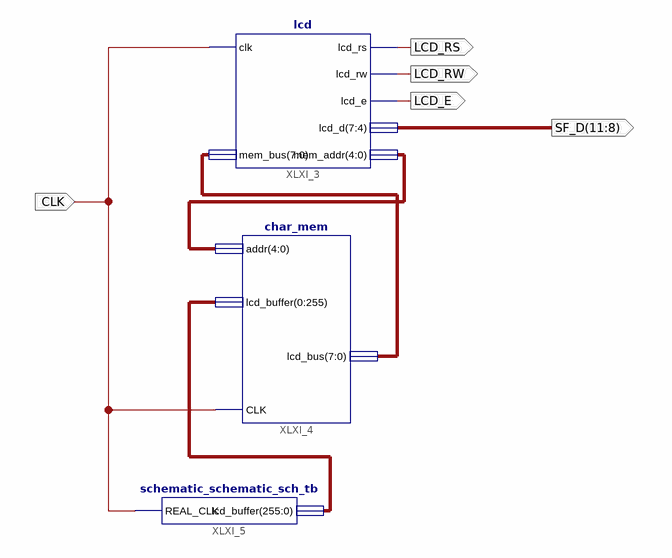
[diagram p0: schematic sheet 1]
// Xilinx ISE schematic CPU_TB_LCD.sch (spartan3e) as structural Verilog: 3 symbols, 5 ports
module CPU_TB_LCD (
  input  CLK,
  output LCD_E,
  output LCD_RW,
  output LCD_RS,
  output [11:8] SF_D
);

  wire [4:0] XLXN_2;
  wire [7:0] XLXN_28;
  wire [255:0] XLXN_13;

  lcd XLXI_3 (
    .clk(CLK), .mem_bus(XLXN_28), .lcd_rs(LCD_RS), .lcd_rw(LCD_RW), .lcd_e(LCD_E), .lcd_d(SF_D),
    .mem_addr(XLXN_2));
  char_mem XLXI_4 (
    .addr(XLXN_2),
    .lcd_buffer({XLXN_13[0], XLXN_13[1], XLXN_13[2], XLXN_13[3], XLXN_13[4], XLXN_13[5], XLXN_13[6], XLXN_13[7], XLXN_13[8], XLXN_13[9], XLXN_13[10], XLXN_13[11], XLXN_13[12], XLXN_13[13], XLXN_13[14], XLXN_13[15], XLXN_13[16], XLXN_13[17], XLXN_13[18], XLXN_13[19], XLXN_13[20], XLXN_13[21], XLXN_13[22], XLXN_13[23], XLXN_13[24], XLXN_13[25], XLXN_13[26], XLXN_13[27], XLXN_13[28], XLXN_13[29], XLXN_13[30], XLXN_13[31], XLXN_13[32], XLXN_13[33], XLXN_13[34], XLXN_13[35], XLXN_13[36], XLXN_13[37], XLXN_13[38], XLXN_13[39], XLXN_13[40], XLXN_13[41], XLXN_13[42], XLXN_13[43], XLXN_13[44], XLXN_13[45], XLXN_13[46], XLXN_13[47], XLXN_13[48], XLXN_13[49], XLXN_13[50], XLXN_13[51], XLXN_13[52], XLXN_13[53], XLXN_13[54], XLXN_13[55], XLXN_13[56], XLXN_13[57], XLXN_13[58], XLXN_13[59], XLXN_13[60], XLXN_13[61], XLXN_13[62], XLXN_13[63], XLXN_13[64], XLXN_13[65], XLXN_13[66], XLXN_13[67], XLXN_13[68], XLXN_13[69], XLXN_13[70], XLXN_13[71], XLXN_13[72], XLXN_13[73], XLXN_13[74], XLXN_13[75], XLXN_13[76], XLXN_13[77], XLXN_13[78], XLXN_13[79], XLXN_13[80], XLXN_13[81], XLXN_13[82], XLXN_13[83], XLXN_13[84], XLXN_13[85], XLXN_13[86], XLXN_13[87], XLXN_13[88], XLXN_13[89], XLXN_13[90], XLXN_13[91], XLXN_13[92], XLXN_13[93], XLXN_13[94], XLXN_13[95], XLXN_13[96], XLXN_13[97], XLXN_13[98], XLXN_13[99], XLXN_13[100], XLXN_13[101], XLXN_13[102], XLXN_13[103], XLXN_13[104], XLXN_13[105], XLXN_13[106], XLXN_13[107], XLXN_13[108], XLXN_13[109], XLXN_13[110], XLXN_13[111], XLXN_13[112], XLXN_13[113], XLXN_13[114], XLXN_13[115], XLXN_13[116], XLXN_13[117], XLXN_13[118], XLXN_13[119], XLXN_13[120], XLXN_13[121], XLXN_13[122], XLXN_13[123], XLXN_13[124], XLXN_13[125], XLXN_13[126], XLXN_13[127], XLXN_13[128], XLXN_13[129], XLXN_13[130], XLXN_13[131], XLXN_13[132], XLXN_13[133], XLXN_13[134], XLXN_13[135], XLXN_13[136], XLXN_13[137], XLXN_13[138], XLXN_13[139], XLXN_13[140], XLXN_13[141], XLXN_13[142], XLXN_13[143], XLXN_13[144], XLXN_13[145], XLXN_13[146], XLXN_13[147], XLXN_13[148], XLXN_13[149], XLXN_13[150], XLXN_13[151], XLXN_13[152], XLXN_13[153], XLXN_13[154], XLXN_13[155], XLXN_13[156], XLXN_13[157], XLXN_13[158], XLXN_13[159], XLXN_13[160], XLXN_13[161], XLXN_13[162], XLXN_13[163], XLXN_13[164], XLXN_13[165], XLXN_13[166], XLXN_13[167], XLXN_13[168], XLXN_13[169], XLXN_13[170], XLXN_13[171], XLXN_13[172], XLXN_13[173], XLXN_13[174], XLXN_13[175], XLXN_13[176], XLXN_13[177], XLXN_13[178], XLXN_13[179], XLXN_13[180], XLXN_13[181], XLXN_13[182], XLXN_13[183], XLXN_13[184], XLXN_13[185], XLXN_13[186], XLXN_13[187], XLXN_13[188], XLXN_13[189], XLXN_13[190], XLXN_13[191], XLXN_13[192], XLXN_13[193], XLXN_13[194], XLXN_13[195], XLXN_13[196], XLXN_13[197], XLXN_13[198], XLXN_13[199], XLXN_13[200], XLXN_13[201], XLXN_13[202], XLXN_13[203], XLXN_13[204], XLXN_13[205], XLXN_13[206], XLXN_13[207], XLXN_13[208], XLXN_13[209], XLXN_13[210], XLXN_13[211], XLXN_13[212], XLXN_13[213], XLXN_13[214], XLXN_13[215], XLXN_13[216], XLXN_13[217], XLXN_13[218], XLXN_13[219], XLXN_13[220], XLXN_13[221], XLXN_13[222], XLXN_13[223], XLXN_13[224], XLXN_13[225], XLXN_13[226], XLXN_13[227], XLXN_13[228], XLXN_13[229], XLXN_13[230], XLXN_13[231], XLXN_13[232], XLXN_13[233], XLXN_13[234], XLXN_13[235], XLXN_13[236], XLXN_13[237], XLXN_13[238], XLXN_13[239], XLXN_13[240], XLXN_13[241], XLXN_13[242], XLXN_13[243], XLXN_13[244], XLXN_13[245], XLXN_13[246], XLXN_13[247], XLXN_13[248], XLXN_13[249], XLXN_13[250], XLXN_13[251], XLXN_13[252], XLXN_13[253], XLXN_13[254], XLXN_13[255]}),
    .lcd_bus(XLXN_28), .CLK(CLK));
  schematic_schematic_sch_tb XLXI_5 (
    .REAL_CLK(CLK),
    .lcd_buffer({XLXN_13[0], XLXN_13[1], XLXN_13[2], XLXN_13[3], XLXN_13[4], XLXN_13[5], XLXN_13[6], XLXN_13[7], XLXN_13[8], XLXN_13[9], XLXN_13[10], XLXN_13[11], XLXN_13[12], XLXN_13[13], XLXN_13[14], XLXN_13[15], XLXN_13[16], XLXN_13[17], XLXN_13[18], XLXN_13[19], XLXN_13[20], XLXN_13[21], XLXN_13[22], XLXN_13[23], XLXN_13[24], XLXN_13[25], XLXN_13[26], XLXN_13[27], XLXN_13[28], XLXN_13[29], XLXN_13[30], XLXN_13[31], XLXN_13[32], XLXN_13[33], XLXN_13[34], XLXN_13[35], XLXN_13[36], XLXN_13[37], XLXN_13[38], XLXN_13[39], XLXN_13[40], XLXN_13[41], XLXN_13[42], XLXN_13[43], XLXN_13[44], XLXN_13[45], XLXN_13[46], XLXN_13[47], XLXN_13[48], XLXN_13[49], XLXN_13[50], XLXN_13[51], XLXN_13[52], XLXN_13[53], XLXN_13[54], XLXN_13[55], XLXN_13[56], XLXN_13[57], XLXN_13[58], XLXN_13[59], XLXN_13[60], XLXN_13[61], XLXN_13[62], XLXN_13[63], XLXN_13[64], XLXN_13[65], XLXN_13[66], XLXN_13[67], XLXN_13[68], XLXN_13[69], XLXN_13[70], XLXN_13[71], XLXN_13[72], XLXN_13[73], XLXN_13[74], XLXN_13[75], XLXN_13[76], XLXN_13[77], XLXN_13[78], XLXN_13[79], XLXN_13[80], XLXN_13[81], XLXN_13[82], XLXN_13[83], XLXN_13[84], XLXN_13[85], XLXN_13[86], XLXN_13[87], XLXN_13[88], XLXN_13[89], XLXN_13[90], XLXN_13[91], XLXN_13[92], XLXN_13[93], XLXN_13[94], XLXN_13[95], XLXN_13[96], XLXN_13[97], XLXN_13[98], XLXN_13[99], XLXN_13[100], XLXN_13[101], XLXN_13[102], XLXN_13[103], XLXN_13[104], XLXN_13[105], XLXN_13[106], XLXN_13[107], XLXN_13[108], XLXN_13[109], XLXN_13[110], XLXN_13[111], XLXN_13[112], XLXN_13[113], XLXN_13[114], XLXN_13[115], XLXN_13[116], XLXN_13[117], XLXN_13[118], XLXN_13[119], XLXN_13[120], XLXN_13[121], XLXN_13[122], XLXN_13[123], XLXN_13[124], XLXN_13[125], XLXN_13[126], XLXN_13[127], XLXN_13[128], XLXN_13[129], XLXN_13[130], XLXN_13[131], XLXN_13[132], XLXN_13[133], XLXN_13[134], XLXN_13[135], XLXN_13[136], XLXN_13[137], XLXN_13[138], XLXN_13[139], XLXN_13[140], XLXN_13[141], XLXN_13[142], XLXN_13[143], XLXN_13[144], XLXN_13[145], XLXN_13[146], XLXN_13[147], XLXN_13[148], XLXN_13[149], XLXN_13[150], XLXN_13[151], XLXN_13[152], XLXN_13[153], XLXN_13[154], XLXN_13[155], XLXN_13[156], XLXN_13[157], XLXN_13[158], XLXN_13[159], XLXN_13[160], XLXN_13[161], XLXN_13[162], XLXN_13[163], XLXN_13[164], XLXN_13[165], XLXN_13[166], XLXN_13[167], XLXN_13[168], XLXN_13[169], XLXN_13[170], XLXN_13[171], XLXN_13[172], XLXN_13[173], XLXN_13[174], XLXN_13[175], XLXN_13[176], XLXN_13[177], XLXN_13[178], XLXN_13[179], XLXN_13[180], XLXN_13[181], XLXN_13[182], XLXN_13[183], XLXN_13[184], XLXN_13[185], XLXN_13[186], XLXN_13[187], XLXN_13[188], XLXN_13[189], XLXN_13[190], XLXN_13[191], XLXN_13[192], XLXN_13[193], XLXN_13[194], XLXN_13[195], XLXN_13[196], XLXN_13[197], XLXN_13[198], XLXN_13[199], XLXN_13[200], XLXN_13[201], XLXN_13[202], XLXN_13[203], XLXN_13[204], XLXN_13[205], XLXN_13[206], XLXN_13[207], XLXN_13[208], XLXN_13[209], XLXN_13[210], XLXN_13[211], XLXN_13[212], XLXN_13[213], XLXN_13[214], XLXN_13[215], XLXN_13[216], XLXN_13[217], XLXN_13[218], XLXN_13[219], XLXN_13[220], XLXN_13[221], XLXN_13[222], XLXN_13[223], XLXN_13[224], XLXN_13[225], XLXN_13[226], XLXN_13[227], XLXN_13[228], XLXN_13[229], XLXN_13[230], XLXN_13[231], XLXN_13[232], XLXN_13[233], XLXN_13[234], XLXN_13[235], XLXN_13[236], XLXN_13[237], XLXN_13[238], XLXN_13[239], XLXN_13[240], XLXN_13[241], XLXN_13[242], XLXN_13[243], XLXN_13[244], XLXN_13[245], XLXN_13[246], XLXN_13[247], XLXN_13[248], XLXN_13[249], XLXN_13[250], XLXN_13[251], XLXN_13[252], XLXN_13[253], XLXN_13[254], XLXN_13[255]}));
endmodule
